# Altium schematic sheet LED Matrix.SchDoc
size A4; Date: 29 Jul 2025; CompanyName: Abdullah; Engineer: Abdullah; Revision: 2; SheetNumber: 2; SheetTotal: 4
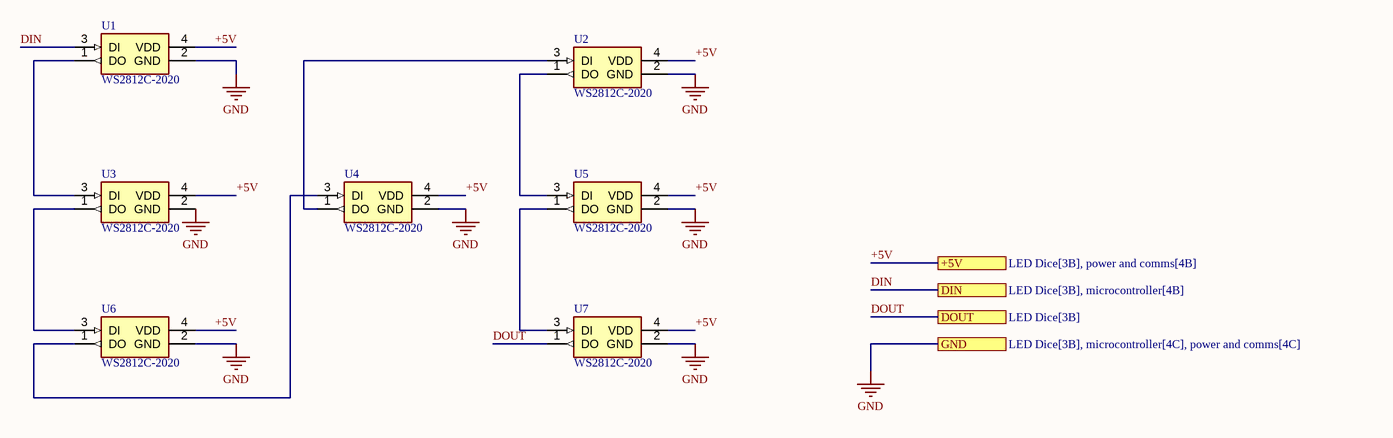
[diagram p0: LED Matrix.SchDoc]

## Parts
U1  WS2812C-2020  [LED_WS2812C-2020]
U2  WS2812C-2020  [LED_WS2812C-2020]
U3  WS2812C-2020  [LED_WS2812C-2020]
U4  WS2812C-2020  [LED_WS2812C-2020]
U5  WS2812C-2020  [LED_WS2812C-2020]
U6  WS2812C-2020  [LED_WS2812C-2020]
U7  WS2812C-2020  [LED_WS2812C-2020]

## Ports
+5V (see LED Dice[3B], power and comms[4B]), DIN (see LED Dice[3B], microcontroller[4B]), DOUT (see LED Dice[3B]), GND (see LED Dice[3B], microcontroller[4C], power and comms[4C])

## Nets
GND: U1.2(GND) U2.2(GND) U3.2(GND) U4.2(GND) U5.2(GND) U6.2(GND) U7.2(GND) ; port GND
+5V: U1.4(VDD) U2.4(VDD) U3.4(VDD) U4.4(VDD) U5.4(VDD) U6.4(VDD) U7.4(VDD) ; port +5V
DIN: U1.3(DI) ; port DIN
DOUT: U7.1(DO) ; port DOUT
NetU1_1: U1.1(DO) U3.3(DI)
NetU2_1: U2.1(DO) U5.3(DI)
NetU2_3: U2.3(DI) U4.1(DO)
NetU3_1: U3.1(DO) U6.3(DI)
NetU4_3: U4.3(DI) U6.1(DO)
NetU5_1: U5.1(DO) U7.3(DI)

## Notes on the sheet
- Project Title
- Engineer
- Company
- Revision
- Date
- Doc Name:
- Sheet
- of

## Library data of the parts
U1-U7 = WS2812C-2020: Intelligent control LED integrated light source; MF: Worldsemi; SnapEDA_Link: https://www.snapeda.com/parts/WS2812C-2020/Worldsemi/view-part/?ref=snap; Package: Package; Value: *; MP: WS2812C-2020; Check_prices: https://www.snapeda.com/parts/WS2812C-2020/Worldsemi/view-part/?ref=eda